# Altium schematic sheet Xplorer_camera.SchDoc
size A3
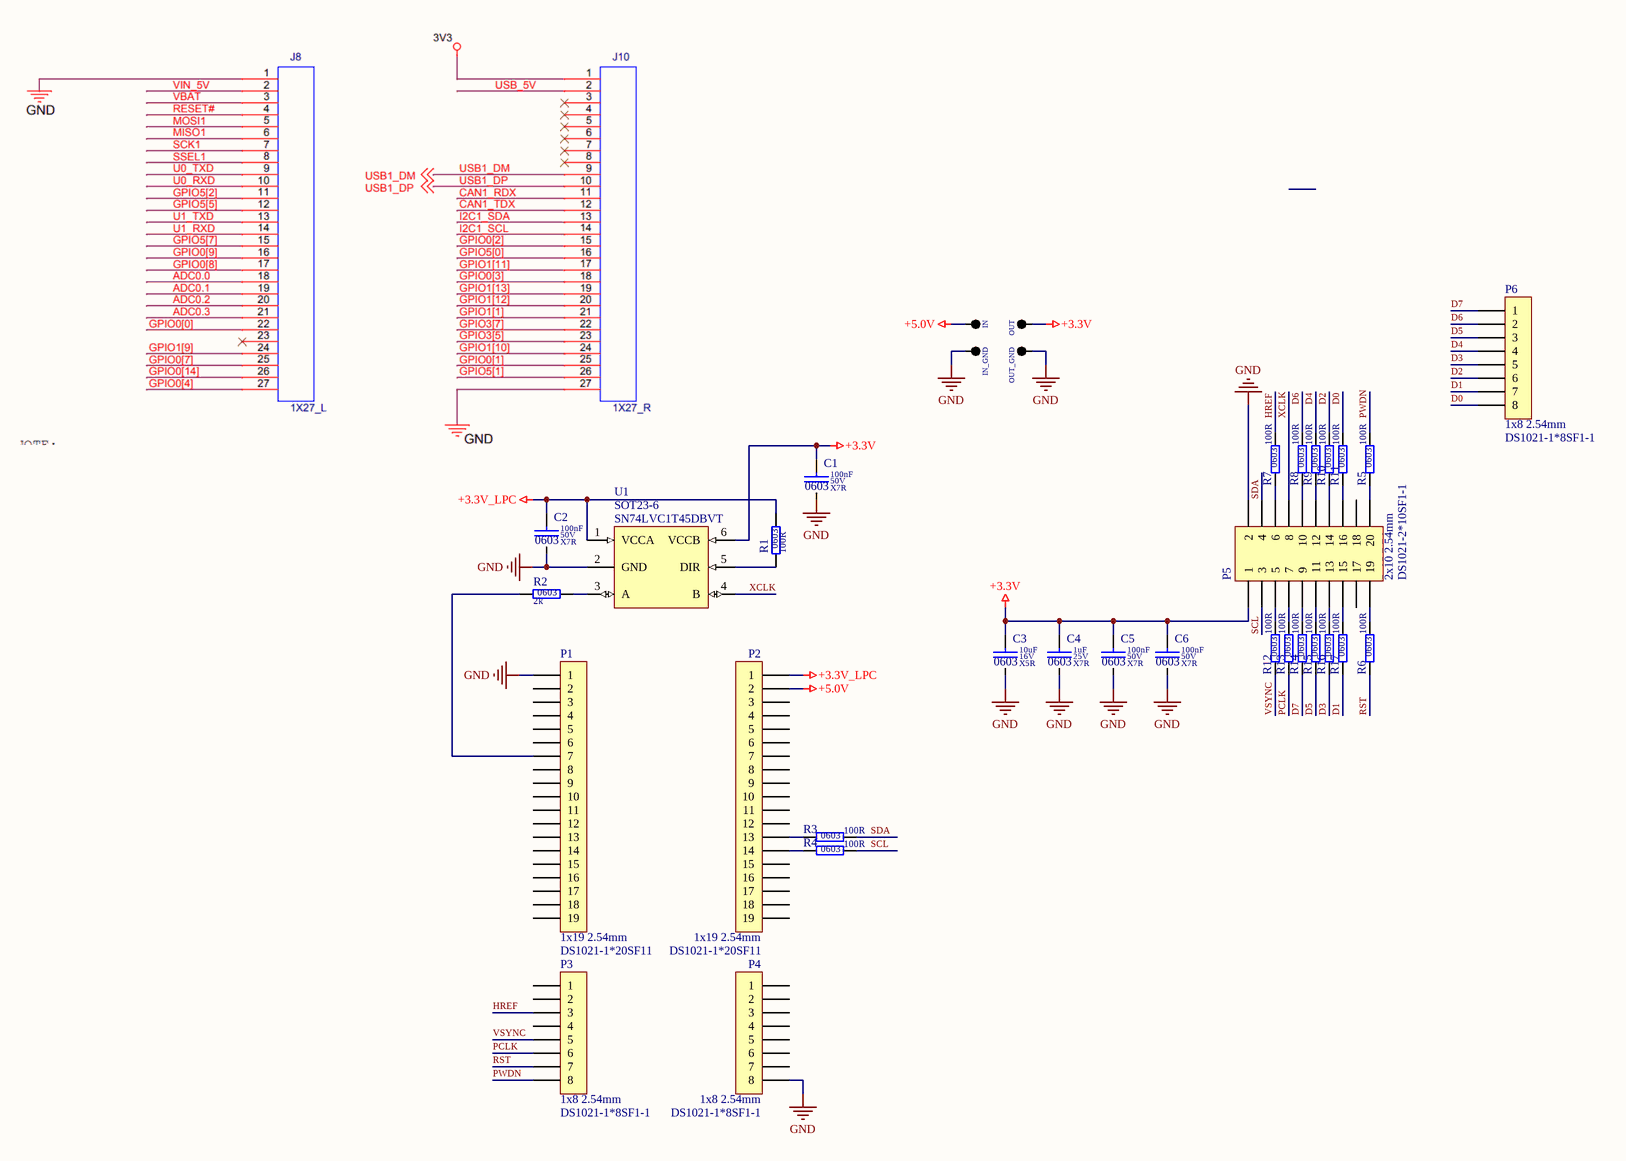
[diagram p0: Xplorer_camera.SchDoc]

## Parts
C1  value 100nF  Dielectric: X7R  Voltage: 50V  SCH_Footprint: 0603  [C_0603_1608]  (hidden comment: Ceramic X7R)
C2  value 100nF  Dielectric: X7R  Voltage: 50V  SCH_Footprint: 0603  [C_0603_1608]  (hidden comment: Ceramic X7R)
C3  value 10uF  Dielectric: X5R  Voltage: 16V  SCH_Footprint: 0603  [C_0603_1608]  (hidden comment: Ceramic X5R)
C4  value 1uF  Dielectric: X7R  Voltage: 25V  SCH_Footprint: 0603  [C_0603_1608]  (hidden comment: Ceramic X7R)
C5  value 100nF  Dielectric: X7R  Voltage: 50V  SCH_Footprint: 0603  [C_0603_1608]  (hidden comment: Ceramic X7R)
C6  value 100nF  Dielectric: X7R  Voltage: 50V  SCH_Footprint: 0603  [C_0603_1608]  (hidden comment: Ceramic X7R)
IN  Single pin  [TP_1PIN]  (value not drawn)
IN_GND  Single pin  [TP_1PIN]  (value not drawn)
OUT  Single pin  [TP_1PIN]  (value not drawn)
OUT_GND  Single pin  [TP_1PIN]  (value not drawn)
P1  value DS1021-1*20SF11  SCH_Footprint: 1x19 2.54mm  [P_HEADER_1x19_2.54]  (hidden comment: Goldpin)
P2  value DS1021-1*20SF11  SCH_Footprint: 1x19 2.54mm  [P_HEADER_1x19_2.54]  (hidden comment: Goldpin)
P3  value DS1021-1*8SF1-1  SCH_Footprint: 1x8 2.54mm  [P_HEADER_1x8_2.54]  (hidden comment: Goldpin)
P4  value DS1021-1*8SF1-1  SCH_Footprint: 1x8 2.54mm  [P_HEADER_1x8_2.54]  (hidden comment: Goldpin)
P5  value DS1021-2*10SF1-1  SCH_Footprint: 2x10 2.54mm  [P_HEADER_2x10_2.54]  (hidden comment: Goldpin male)
P6  value DS1021-1*8SF1-1  SCH_Footprint: 1x8 2.54mm  [P_HEADER_1x8_2.54]  (hidden comment: Goldpin)
R1  value 100R  SCH_Footprint: 0603  [R_0603_1608]  (hidden comment: Resistor)
R2  value 2k  SCH_Footprint: 0603  [R_0603_1608]  (hidden comment: Resistor)
R3  value 100R  SCH_Footprint: 0603  [R_0603_1608]  (hidden comment: Resistor)
R4  value 100R  SCH_Footprint: 0603  [R_0603_1608]  (hidden comment: Resistor)
R5  value 100R  SCH_Footprint: 0603  [R_0603_1608]  (hidden comment: Resistor)
R6  value 100R  SCH_Footprint: 0603  [R_0603_1608]  (hidden comment: Resistor)
R7  value 100R  SCH_Footprint: 0603  [R_0603_1608]  (hidden comment: Resistor)
R8  value 100R  SCH_Footprint: 0603  [R_0603_1608]  (hidden comment: Resistor)
R9  value 100R  SCH_Footprint: 0603  [R_0603_1608]  (hidden comment: Resistor)
R10  value 100R  SCH_Footprint: 0603  [R_0603_1608]  (hidden comment: Resistor)
R11  value 100R  SCH_Footprint: 0603  [R_0603_1608]  (hidden comment: Resistor)
R12  value 100R  SCH_Footprint: 0603  [R_0603_1608]  (hidden comment: Resistor)
R13  value 100R  SCH_Footprint: 0603  [R_0603_1608]  (hidden comment: Resistor)
R14  value 100R  SCH_Footprint: 0603  [R_0603_1608]  (hidden comment: Resistor)
R15  value 100R  SCH_Footprint: 0603  [R_0603_1608]  (hidden comment: Resistor)
R16  value 100R  SCH_Footprint: 0603  [R_0603_1608]  (hidden comment: Resistor)
R17  value 100R  SCH_Footprint: 0603  [R_0603_1608]  (hidden comment: Resistor)
U1  value SN74LVC1T45DBVT  SCH_Footprint: SOT23-6  [SOT23-6_SC74A_SOT753]  (hidden comment: Single-Bit Dual-Supply Bus Transceiver)

## Nets
+3.3V: C1.1 C3.1 C4.1 C5.1 C6.1 OUT.1(TP) P5.1 U1.6(VCCB)
+3.3V_LPC: C2.1 P2.1 R1.2 U1.1(VCCA)
+5.0V: IN.1(TP) P2.2
GND: C1.2 C2.2 C3.2 C4.2 C5.2 C6.2 IN_GND.1(TP) OUT_GND.1(TP) P1.1 P4.8 P5.2 U1.2(GND)
D0: P6.8 R11.2
D1: P6.7 R17.1
D2: P6.6 R10.2
D3: P6.5 R16.1
D4: P6.4 R9.2
D5: P6.3 R15.1
D6: P6.2 R8.2
D7: P6.1 R14.1
HREF: P3.3 R7.2
PCLK: P3.6 R13.1
PWDN: P3.8 R5.2
RST: P3.7 R6.1
SCL: P5.3 R4.2
SDA: P5.4 R3.2
VSYNC: P3.5 R12.1
XCLK: P5.8 U1.4(B)
NetP1_7: P1.7 R2.1
NetP2_13: P2.13 R3.1
NetP2_14: P2.14 R4.1
NetP5_5: P5.5 R12.2
NetP5_6: P5.6 R7.1
NetP5_7: P5.7 R13.2
NetP5_9: P5.9 R14.2
NetP5_10: P5.10 R8.1
NetP5_11: P5.11 R15.2
NetP5_12: P5.12 R9.1
NetP5_13: P5.13 R16.2
NetP5_14: P5.14 R10.1
NetP5_15: P5.15 R17.2
NetP5_16: P5.16 R11.1
NetP5_19: P5.19 R6.2
NetP5_20: P5.20 R5.1
NetR1_1: R1.1 U1.5(DIR)
NetR2_2: R2.2 U1.3(A)

Not connected (* = marked no-connect by the designer): P1 2 3 4 5 6 8 9 10 11 12 13 14 15 16 17 18 19; P2 3 4 5 6 7 8 9 10 11 12 15 16 17 18 19; P3 1 2 4; P4 1 2 3 4 5 6 7; P5 17 18

## Notes on the sheet
- Title
- Size:
- Date:
- A3
- Number:
- Time:
- Revision:
- Sheet
- of
- File:

## Library data of the parts
C1 C2 C5 C6 = C_100nF_50V_X7R_0603_5: Capacitor; Manufacturer: Samsung; Manufacturer Part Number: CL10B104JB8NNNC; Tolerance (%): 5; Part Number: C_100nF_50V_X7R_0603_5; HelpURL: http://www.tme.eu/pl/Document/4a42202b32dab16128fe107dd69598cc/samsung-chip-cap.pdf; Supplier 1: TME; Supplier Part Number 1: CL10B104JB8NNNC; Supplier 2: RS Components; Supplier 3: Farnell; Supplier 4: Mouser; Supplier 5: Digi-Key; Supplier 6: LCSC
C3 = C_10uF_16V_X5R_0603_20: Capacitor; Manufacturer: Samsung Electro-Mechanics; Manufacturer Part Number: CL10A106MO8NQNC; Tolerance (%): 20; Part Number: C_10uF_16V_X5R_0603_20; HelpURL: http://www.tme.eu/pl/Document/4a42202b32dab16128fe107dd69598cc/samsung-chip-cap.pdf; Supplier 1: TME; Supplier Part Number 1: CL10A106MO8NQNC; Supplier 2: RS Components; Supplier 3: Farnell; Supplier 4: Mouser; Supplier 5: Digi-Key; Supplier 6: LCSC
C4 = C_1uF_25V_X7R_0603_10: Capacitor; Manufacturer: Samsung; Manufacturer Part Number: CL10B105KA8NNNC; Tolerance (%): 10; Part Number: C_1uF_25V_X7R_0603_10; HelpURL: http://www.tme.eu/pl/Document/4a42202b32dab16128fe107dd69598cc/samsung-chip-cap.pdf; Supplier 1: TME; Supplier Part Number 1: CL10B105KA8NNNC; Supplier 2: RS Components; Supplier 3: Farnell; Supplier 4: Mouser; Supplier 5: Digi-Key; Supplier 6: LCSC
IN IN_GND OUT OUT_GND = TP_1PIN: Testpoint; SCH_Footprint: Single; Part Number: TP_1PIN; Supplier 1: TME; Supplier 2: RS Components; Supplier 3: Farnell; Supplier 4: Mouser; Supplier 5: Digi-Key; Supplier 6: LCSC
P1 P2 = P_HEADER_1x19_2.54: Pin Header; Manufacturer: Connfly; Part Number: P_HEADER_1x19_2.54; HelpURL: http://www.tme.eu/pl/Document/cc301e58a5da78cb543a94b5a5b7f06a/DS1021.pdf; Manufacturer Part Number: DS1021-1*20SF11; Supplier 1: TME; Supplier Part Number 1: ZL201-20G; Supplier 2: RS Components; Supplier 3: Farnell; Supplier 4: Mouser; Supplier 5: Digi-Key; Supplier 6: LCSC
P3 P4 P6 = P_HEADER_1x8_2.54: Pin Header; Manufacturer: Connfly; Part Number: P_HEADER_1x8_2.54; HelpURL: http://www.tme.eu/en/Document/cc301e58a5da78cb543a94b5a5b7f06a/DS1021.pdf; Manufacturer Part Number: DS1021-1*8SF1-1; Supplier 1: TME; Supplier Part Number 1: ZL201-08G; Supplier 2: RS Components; Supplier 3: Farnell; Supplier 4: Mouser; Supplier 5: Digi-Key; Supplier 6: LCSC
P5 = P_HEADER_2x10_2.54: Pin Header; Manufacturer: Connfly; Part Number: P_HEADER_2x10_2.54; HelpURL: https://www.tme.eu/Document/cc301e58a5da78cb543a94b5a5b7f06a/DS1021.pdf; Manufacturer Part Number: DS1021-2*10SF1-1; Supplier 1: TME; Supplier Part Number 1: ZL202-20G; Supplier 2: RS Components; Supplier 3: Farnell; Supplier 4: Mouser; Supplier 5: Digi-Key; Supplier 6: LCSC
R1 R3-R17 = R_100R_0603_1: Manufacturer: Yageo; Manufacturer Part Number: RC0603FR-07100RL; Voltage: 50V; Power: 100mW; Tolerance: 1%; Part Number: R_100R_0603_1; HelpURL: http://www.tme.eu/en/Document/d2a72e545e5c8eb7bf2a04fa97535928/rc0603yageo.pdf; Supplier 1: TME; Supplier Part Number 1: RC0603FR-07100R; Supplier 2: RS Components; Supplier 3: Farnell; Supplier Part Number 3: 2131804; Supplier 4: Mouser; Supplier Part Number 4: 603-RC0603FR-07100RL; Supplier 5: Digi-Key; Supplier Part Number 5: 311-100HRCT-ND; Supplier 6: LCSC
R2 = R_2k_0603_1: Manufacturer: Yageo; Manufacturer Part Number: RC0603FR-072KL; Voltage: 50V; Power: 100mW; Tolerance: 1%; Part Number: R_2k_0603_1; HelpURL: http://datasheet.octopart.com/RC0603FR-072KL-Yageo-datasheet-8328172.pdf; Supplier 1: TME; Supplier Part Number 1: RC0603FR-072K; Supplier 2: RS Components; Supplier 3: Farnell; Supplier 4: Mouser; Supplier Part Number 4: 603-RC0603FR-072KL; Supplier 5: Digi-Key; Supplier Part Number 5: 311-2.00KHRCT-ND; Supplier 6: LCSC
U1 = U_SN74LVC1T45DBVT: This single-bit noninverting bus transceiver uses two separate configurable power-supply rails.  VCCA and VCCB accepts any supply voltage from 1.65 V to 5.5 V. DIR low B->A, DIR high A->B; Manufacturer: Texas Instruments; Part Number: U_SN74LVC1T45DBVT; HelpURL: http://www.ti.com/lit/ds/symlink/sn74lvc1t45.pdf; Manufacturer Part Number: SN74LVC1T45DBVT; Supplier 1: TME; Supplier Part Number 1: SN74LVC1T45DBVT; Supplier 2: RS Components; Supplier Part Number 2: 6628825P; Supplier 3: Farnell; Supplier Part Number 3: 1470916; Supplier 4: Mouser; Supplier Part Number 4: 595-SN74LVC1T45DBVT; Supplier 5: Digi-Key; Supplier Part Number 5: 296-30381-1-ND; Supplier 6: LCSC